# Altium schematic sheet MCU_STM32H743BI.SchDoc: MCU_STM32H743BI
size A3; Author: A.Horvath; Organization: Reichle & De-Massari; Address1: Binzstrasse 32; Address2: 8620 Wetzikon; Address3: Switzerland; DocumentNumber: 10; Revision: V0.1; SheetNumber: 10; SheetTotal: 11
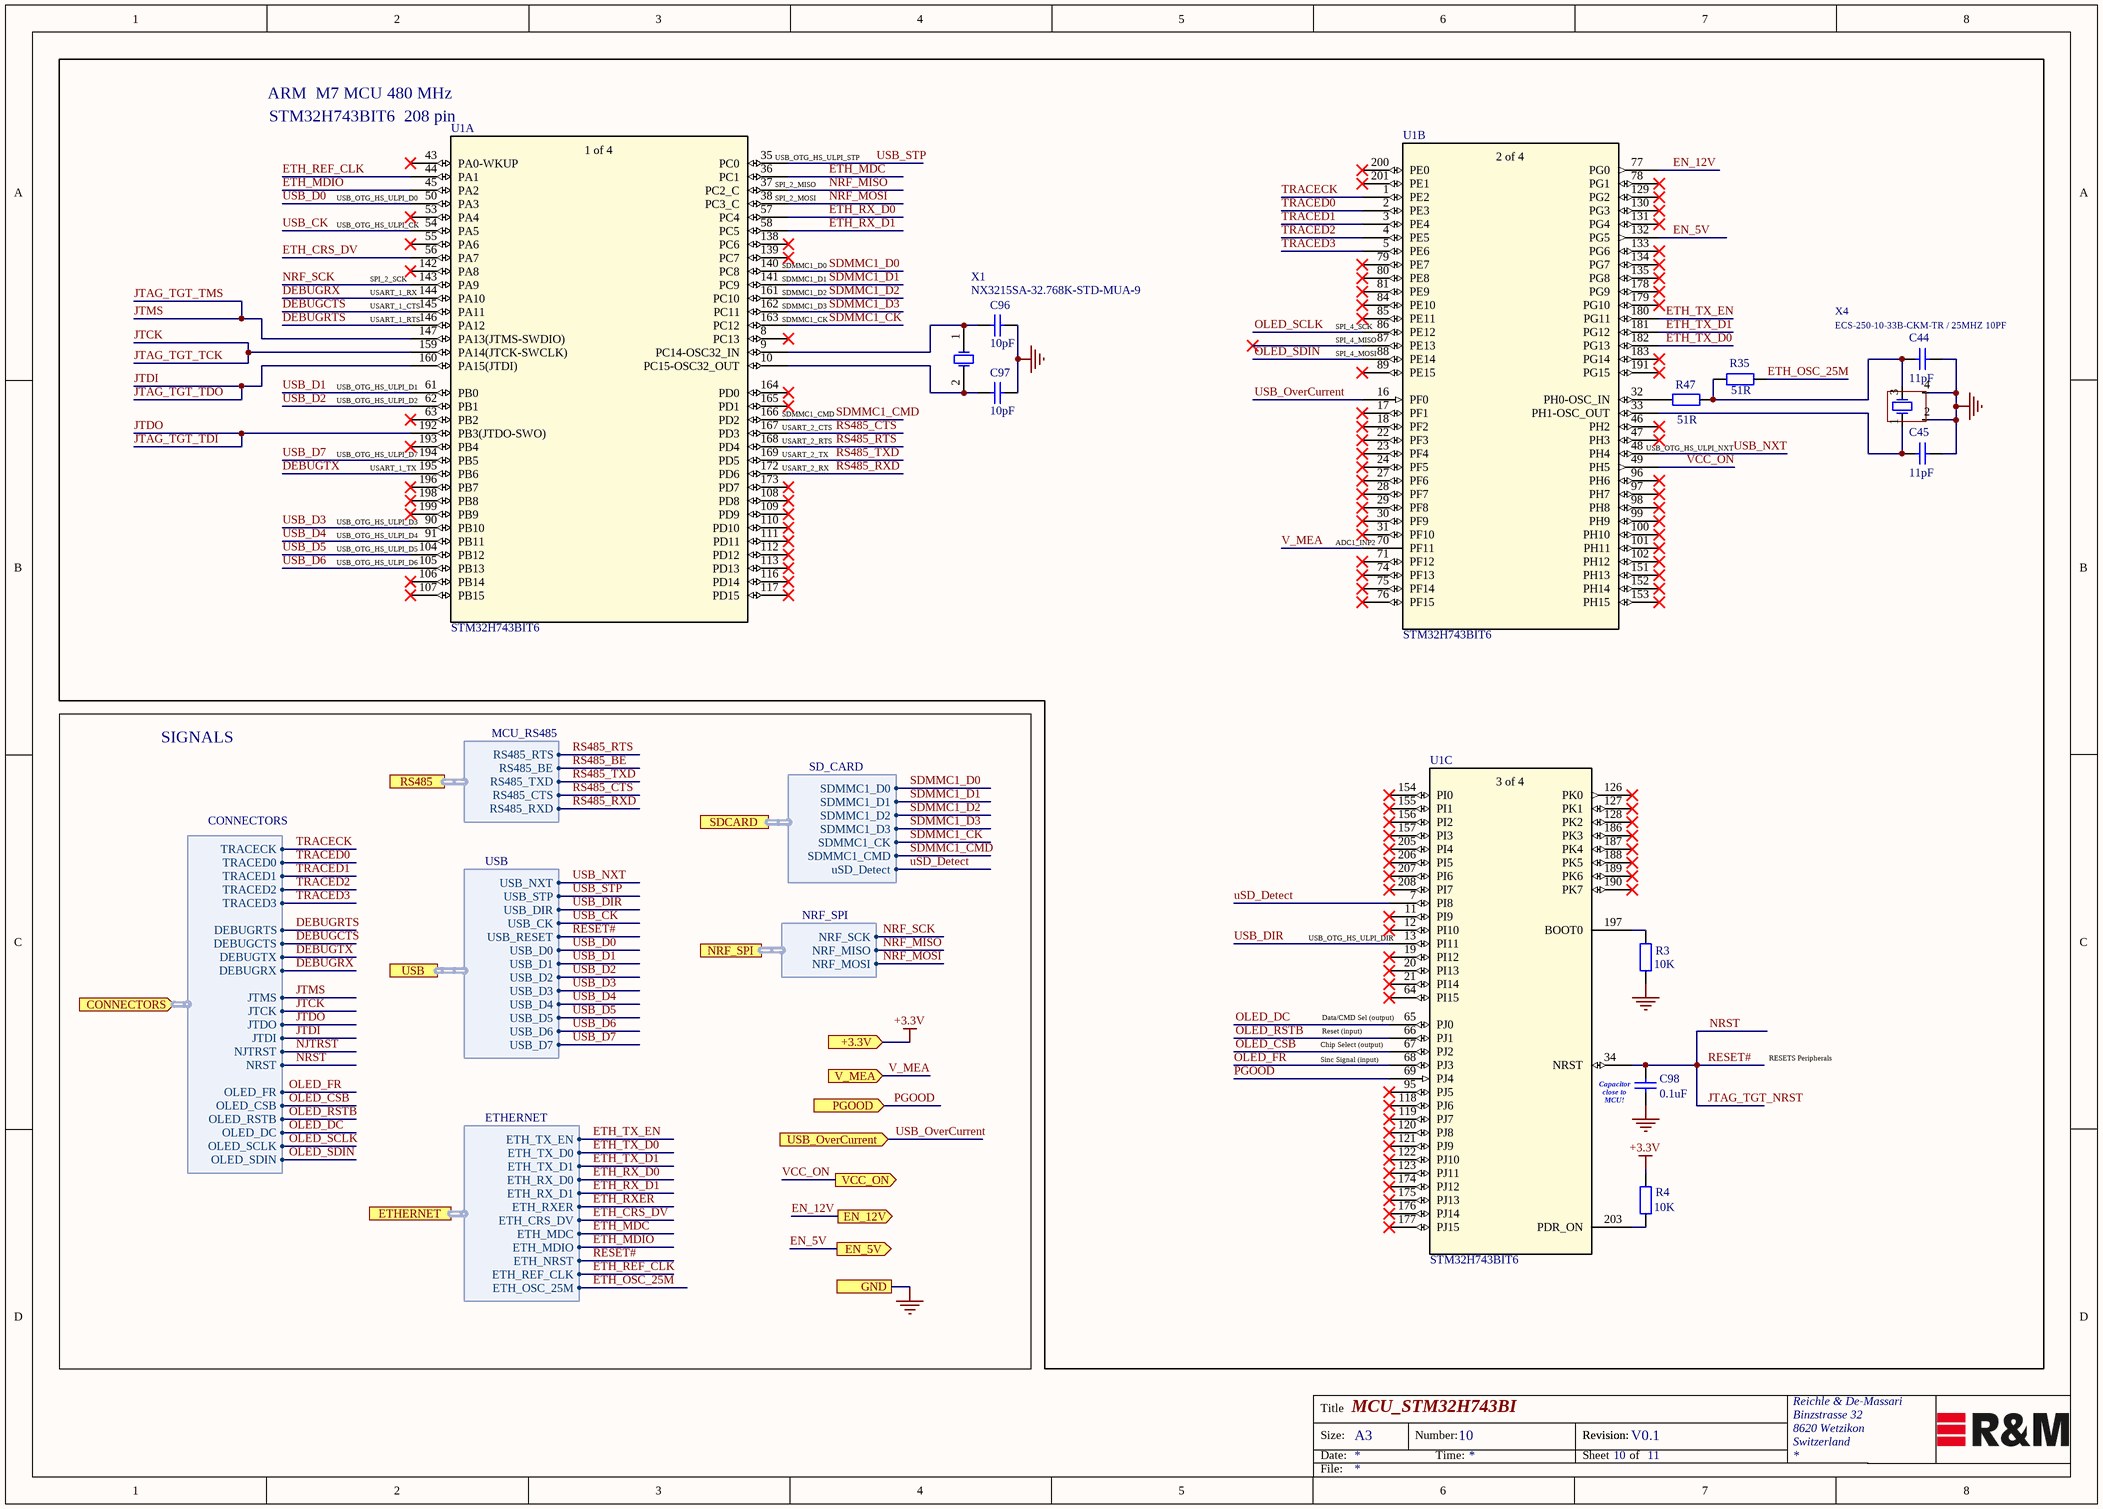
[diagram p0: MCU_STM32H743BI.SchDoc]

## Parts
C44  11pF  [Ceramic Capacitor 0402 EIA]
C45  11pF  [Ceramic Capacitor 0402 EIA]
C96  10pF  [Ceramic Capacitor 0402 EIA]
C97  10pF  [Ceramic Capacitor 0402 EIA]
C98  0.1uF  [Ceramic Capacitor 0402 EIA]
R3  10K  [Resistor 0402 EIA]
R4  10K  [Resistor 0402 EIA]
R35  51R  [Resistor 0402 EIA]
R47  51R  [Resistor 0402 EIA]
U1  STM32H743BIT6  [LQFP208_STM32H743BITx]  (parts A,B,C of 4)
X1  NX3215SA-32.768K-STD-MUA-9  [NX3215SA]
X4  ECS-250-10-33B-CKM-TR / 25MHZ 10PF  [ECS-33B]

## Ports
+3.3V (in), CONNECTORS (in, harness CONNECTORS), EN_5V (out), EN_12V (out), ETHERNET (harness ETHERNET), GND, NRF_SPI (harness NRF_SPI), PGOOD (in), RS485 (harness MCU_RS485), SDCARD (harness SD_CARD), USB (harness USB), USB_OverCurrent (in), V_MEA (in), VCC_ON (out)

## Harnesses
CONNECTORS: OLED_FR, OLED_CSB, OLED_RSTB, OLED_DC, OLED_SCLK, OLED_SDIN, JTMS, JTCK, JTDI, JTDO, NJTRST, NRST, DEBUGRTS, DEBUGCTS, DEBUGTX, DEBUGRX, TRACECK, TRACED0, TRACED1, TRACED2, TRACED3
MCU_RS485: RS485_RXD, RS485_CTS, RS485_TXD, RS485_BE, RS485_RTS
USB: USB_STP, USB_DIR, USB_CK, USB_D0, USB_D1, USB_D2, USB_D3, USB_D4, USB_D5, USB_D6, USB_D7, USB_NXT, USB_RESET
SD_CARD: SDMMC1_D0, SDMMC1_D1, SDMMC1_D2, SDMMC1_D3, SDMMC1_CK, SDMMC1_CMD, uSD_Detect
ETHERNET: ETH_TX_EN, ETH_TX_D0, ETH_TX_D1, ETH_RX_D0, ETH_RX_D1, ETH_RXER, ETH_CRS_DV, ETH_MDC, ETH_MDIO, ETH_NRST, ETH_REF_CLK, ETH_OSC_25M
NRF_SPI: NRF_SCK, NRF_MISO, NRF_MOSI

## Nets
+3.3V: R4.1 ; port +3.3V
GND: C44.1 C45.1 C96.1 C97.1 C98.1 R3.2 X4.2(OSC2) X4.4(OSC3) ; port GND
DEBUGCTS: U1.145(PA11) ; port CONNECTORS.DEBUGCTS
DEBUGRTS: U1.146(PA12) ; port CONNECTORS.DEBUGRTS
DEBUGRX: U1.144(PA10) ; port CONNECTORS.DEBUGRX
DEBUGTX: U1.195(PB6) ; port CONNECTORS.DEBUGTX
EN_5V: U1.132(PG5) ; port EN_5V
EN_12V: U1.77(PG0) ; port EN_12V
ETH_CRS_DV: U1.56(PA7) ; port ETHERNET.ETH_CRS_DV
ETH_MDC: U1.36(PC1) ; port ETHERNET.ETH_MDC
ETH_MDIO: U1.45(PA2) ; port ETHERNET.ETH_MDIO
ETH_OSC_25M: R35.2 ; port ETHERNET.ETH_OSC_25M
ETH_REF_CLK: U1.44(PA1) ; port ETHERNET.ETH_REF_CLK
ETH_RX_D0: U1.57(PC4) ; port ETHERNET.ETH_RX_D0
ETH_RX_D1: U1.58(PC5) ; port ETHERNET.ETH_RX_D1
ETH_RXER: port ETHERNET.ETH_RXER
ETH_TX_D0: U1.182(PG13) ; port ETHERNET.ETH_TX_D0
ETH_TX_D1: U1.181(PG12) ; port ETHERNET.ETH_TX_D1
ETH_TX_EN: U1.180(PG11) ; port ETHERNET.ETH_TX_EN
JTAG_TGT_NRST: C98.2 U1.34(NRST) ; port CONNECTORS.NRST, port USB.USB_RESET, port ETHERNET.ETH_NRST  [also labelled NRST, RESET#]
JTAG_TGT_TCK: U1.159(PA14(JTCK-SWCLK)) ; port CONNECTORS.JTCK  [also labelled JTCK]
JTAG_TGT_TDI: U1.192(PB3(JTDO-SWO)) ; port CONNECTORS.JTDO  [also labelled JTDO]
JTAG_TGT_TDO: U1.160(PA15(JTDI)) ; port CONNECTORS.JTDI  [also labelled JTDI]
JTAG_TGT_TMS: U1.147(PA13(JTMS-SWDIO)) ; port CONNECTORS.JTMS  [also labelled JTMS]
NJTRST: port CONNECTORS.NJTRST
NRF_MISO: U1.37(PC2_C) ; port NRF_SPI.NRF_MISO
NRF_MOSI: U1.38(PC3_C) ; port NRF_SPI.NRF_MOSI
NRF_SCK: U1.143(PA9) ; port NRF_SPI.NRF_SCK
OLED_CSB: U1.67(PJ2) ; port CONNECTORS.OLED_CSB
OLED_DC: U1.65(PJ0) ; port CONNECTORS.OLED_DC
OLED_FR: U1.68(PJ3) ; port CONNECTORS.OLED_FR
OLED_RSTB: U1.66(PJ1) ; port CONNECTORS.OLED_RSTB
OLED_SCLK: U1.86(PE12) ; port CONNECTORS.OLED_SCLK
OLED_SDIN: U1.88(PE14) ; port CONNECTORS.OLED_SDIN
PGOOD: U1.69(PJ4) ; port PGOOD
RS485_BE: port RS485.RS485_BE
RS485_CTS: U1.167(PD3) ; port RS485.RS485_CTS
RS485_RTS: U1.168(PD4) ; port RS485.RS485_RTS
RS485_RXD: U1.172(PD6) ; port RS485.RS485_RXD
RS485_TXD: U1.169(PD5) ; port RS485.RS485_TXD
SDMMC1_CK: U1.163(PC12) ; port SDCARD.SDMMC1_CK
SDMMC1_CMD: U1.166(PD2) ; port SDCARD.SDMMC1_CMD
SDMMC1_D0: U1.140(PC8) ; port SDCARD.SDMMC1_D0
SDMMC1_D1: U1.141(PC9) ; port SDCARD.SDMMC1_D1
SDMMC1_D2: U1.161(PC10) ; port SDCARD.SDMMC1_D2
SDMMC1_D3: U1.162(PC11) ; port SDCARD.SDMMC1_D3
TRACECK: U1.1(PE2) ; port CONNECTORS.TRACECK
TRACED0: U1.2(PE3) ; port CONNECTORS.TRACED0
TRACED1: U1.3(PE4) ; port CONNECTORS.TRACED1
TRACED2: U1.4(PE5) ; port CONNECTORS.TRACED2
TRACED3: U1.5(PE6) ; port CONNECTORS.TRACED3
USB_CK: U1.54(PA5) ; port USB.USB_CK
USB_D0: U1.50(PA3) ; port USB.USB_D0
USB_D1: U1.61(PB0) ; port USB.USB_D1
USB_D2: U1.62(PB1) ; port USB.USB_D2
USB_D3: U1.90(PB10) ; port USB.USB_D3
USB_D4: U1.91(PB11) ; port USB.USB_D4
USB_D5: U1.104(PB12) ; port USB.USB_D5
USB_D6: U1.105(PB13) ; port USB.USB_D6
USB_D7: U1.194(PB5) ; port USB.USB_D7
USB_DIR: U1.13(PI11) ; port USB.USB_DIR
USB_NXT: U1.48(PH4) ; port USB.USB_NXT
USB_OverCurrent: U1.16(PF0) ; port USB_OverCurrent
USB_STP: U1.35(PC0) ; port USB.USB_STP
uSD_Detect: U1.7(PI8) ; port SDCARD.uSD_Detect
V_MEA: U1.70(PF11) ; port V_MEA
VCC_ON: U1.49(PH5) ; port VCC_ON
NetC44_2: C44.2 R35.1 R47.2 X4.3(OSC2)
NetC45_2: C45.2 U1.33(PH1-OSC_OUT) X4.1(OSC1)
NetC96_2: C96.2 U1.9(PC14-OSC32_IN) X1.1(OSC1)
NetC97_2: C97.2 U1.10(PC15-OSC32_OUT) X1.2(OSC2)
NetR3_1: R3.1 U1.197(BOOT0)
NetR4_2: R4.2 U1.203(PDR_ON)
NetR47_1: R47.1 U1.32(PH0-OSC_IN)

Not connected (* = marked no-connect by the designer): U1 8(PC13)* 11(PI9)* 12(PI10)* 17(PF1)* 18(PF2)* 19(PI12)* 20(PI13)* 21(PI14)* 22(PF3)* 23(PF4)* 24(PF5)* 27(PF6)* 28(PF7)* 29(PF8)* 30(PF9)* 31(PF10)* 43(PA0-WKUP)* 46(PH2)* 47(PH3)* 53(PA4)* 55(PA6)* 63(PB2)* 64(PI15)* 71(PF12)* 74(PF13)* 75(PF14)* 76(PF15)* 78(PG1)* 79(PE7)* 80(PE8)* 81(PE9)* 84(PE10)* 85(PE11)* 87(PE13)* 89(PE15)* 95(PJ5)* 96(PH6)* 97(PH7)* 98(PH8)* 99(PH9)* 100(PH10)* 101(PH11)* 102(PH12)* 106(PB14)* 107(PB15)* 108(PD8)* 109(PD9)* 110(PD10)* 111(PD11)* 112(PD12)* 113(PD13)* 116(PD14)* 117(PD15)* 118(PJ6)* 119(PJ7)* 120(PJ8)* 121(PJ9)* 122(PJ10)* 123(PJ11)* 126(PK0)* 127(PK1)* 128(PK2)* 129(PG2)* 130(PG3)* 131(PG4)* 133(PG6)* 134(PG7)* 135(PG8)* 138(PC6)* 139(PC7)* 142(PA8)* 151(PH13)* 152(PH14)* 153(PH15)* 154(PI0)* 155(PI1)* 156(PI2)* 157(PI3)* 164(PD0)* 165(PD1)* 173(PD7)* 174(PJ12)* 175(PJ13)* 176(PJ14)* 177(PJ15)* 178(PG9)* 179(PG10)* 183(PG14)* 186(PK3)* 187(PK4)* 188(PK5)* 189(PK6)* 190(PK7)* 191(PG15)* 193(PB4)* 196(PB7)* 198(PB8)* 199(PB9)* 200(PE0)* 201(PE1)* 205(PI4)* 206(PI5)* 207(PI6)* 208(PI7)*

## Notes on the sheet
- ARM  M7 MCU 480 MHz
- STM32H743BIT6  208 pin
- (near U1) USB_OTG_HS_ULPI_STP
- (near U1) USB_OTG_HS_ULPI_D0
- (near U1) USB_OTG_HS_ULPI_CK
- (near U1) SPI_2_MOSI
- (near U1) SPI_2_MISO
- (near U1) USART_1_CTS
- (near U1) USART_1_RX
- (near U1) SPI_2_SCK
- (near U1) SDMMC1_D1
- (near U1) SDMMC1_D0
- (near U1) SDMMC1_D3
- (near U1) SDMMC1_D2
- (near U1) USART_1_RTS
- (near U1) SDMMC1_CK
- (near U1) SPI_4_SCK
- (near U1) SPI_4_MISO
- (near U1) SPI_4_MOSI
- (near U1) USB_OTG_HS_ULPI_D1
- (near U1) USB_OTG_HS_ULPI_D2
- (near U1) USART_2_CTS
- (near U1) USART_2_RTS
- (near U1) SDMMC1_CMD
- (near U1) USB_OTG_HS_ULPI_NXT
- (near U1) USB_OTG_HS_ULPI_D7
- (near U1) USART_1_TX
- (near U1) USART_2_TX
- (near U1) USART_2_RX
- (near U1) USB_OTG_HS_ULPI_D3
- (near U1) USB_OTG_HS_ULPI_D4
- (near U1) USB_OTG_HS_ULPI_D5
- (near U1) USB_OTG_HS_ULPI_D6
- (near U1) ADC1_INP2
- SIGNALS
- (near U1) USB_OTG_HS_ULPI_DIR
- (near U1) Chip Select (output)
- Reset (input)
- (near U1) Data/CMD Sel (output)
- RESETS Peripherals
- (near U1) Sinc Signal (input)
- Capacitor close to MCU!
- Title
- Size:
- Date:
- A3
- Number:
- Time:
- Revision:
- Sheet
- of
- File:
- (in symbol STM32H7x3BIT, part A) 1 of 4
- (in symbol STM32H7x3BIT, part B) 2 of 4
- (in symbol STM32H7x3BIT, part C) 3 of 4

## Library data of the parts
C44 C45 = Cap_11pF_0402_50V: 11pF ±5% 50V Ceramic Capacitor C0G, NP0 0402 (1005 Metric); Manufacturer: Murata; Manufacturer PartNr: GRM1555C1H110JA01D; voltage: 50VDC; Replaceable: yes; Dielectric Grade: C0G (NP0); value: 11pF; tolerance: 5%; Footprint/Package: 0402 (1005 metric); ComponentLink1Description: mouser; ComponentLink1URL: https://www.mouser.ch/ProductDetail/Murata-Electronics/GRM1555C1H110JA01D?qs=%2fha2pyFadug34NHqLs7eMMmZ4IY%2fB%2fBwtGmZmE%252bqlNJIuNiWKDU4cio3ILTIjZ7Z; Supplier 2: Mouser; Supplier 1: Digi-Key; Supplier Part Number 2: 81-GRM1555C1H110JA1D; Supplier Part Number 1: 490-5923-6-ND
C96 C97 = Cap_10pF_0402_50V: 10pF ±1% 50V Ceramic Capacitor C0G, NP0 0402 (1005 Metric); Manufracturer: Murata Electronics; Manufacturer PartNr: GJM1555C1H100FB01D; voltage: 50VDC; Replaceable: yes; Dielectric Grade: C0G (NP0); tolerance: 1%; ComponentLink1Description: mouser; ComponentLink1URL: https://www.mouser.ch/ProductDetail/Murata-Electronics/GRM155R60J475ME47D?qs=sGAEpiMZZMs0AnBnWHyRQIE6q%2f4qwWvwbJmEUwav8%2f4%3d; Footprint/Package: 0402 (1005 metric); Supplier 2: Mouser; Supplier Part Number 2: 81-GJM1555C1H100FB01; value: 10pF; Supplier 1: Digi-Key; Supplier Part Number 1: 0402 (1005 Metric)
C98 = Cap_0.1uF_0402_10V: 0.1µF ±20% 10V Ceramic Capacitor X5R 0402 (1005 Metric); Manufacturer: Wurth Electronics; Manufacturer PartNr: 885012105010; voltage: 10VDC; Replaceable: yes; value: 0.1uF; tolerance: 20%; Footprint/Package: 0402; Dielectric Grade: X5R; ComponentLink1Description: mouser; ComponentLink1URL: https://www.mouser.ch/ProductDetail/Wurth-Electronics/885012105010?qs=sGAEpiMZZMs0AnBnWHyRQEGbLOF2VP1ihL84oCjXnlO407YOHi%2fQbw%3d%3d; Supplier 3: Mouser; Supplier 2: Farnell; Supplier 1: Digi-Key; Supplier Part Number 1: 732-7487-1-ND; Supplier Part Number 2: 2533928; Supplier Part Number 3: 710-885012105010
R3 R4 = Res_10K_0402: SMD 10K ohm 1% 50V General Purpose; Manufacturer: Yageo; Manufacturer PartNr: RC0402FR-1010KL; power: 63mW; Replaceable: yes; value: 10K; tolerance: 1%; ComponentLink1Description: mouser; ComponentLink1URL: https://www.mouser.ch/ProductDetail/Yageo/RC0402FR-1010KL?qs=sGAEpiMZZMtlubZbdhIBIEgN9MQql2m6Sb2LnYlCICU%3d; Footprint/Package: 0402; Supplier 1: Mouser; Supplier Part Number 1: 603-RC0402FR-1010KL; Supplier 2: Digi-Key; Supplier Part Number 2: *
R35 R47 = Res_51R_0402_0.5%: 51 Ohms ±0.5% 0.063W, 1/16W Chip Resistor 0402 (1005 Metric) Thin Film; Manufacturer: Susumu; Manufacturer PartNr: RR0510R-510-D; power: 62.5mW; Replaceable: yes; value: 51R; tolerance: ±0.5%; Footprint/Package: 0402 (1005  metric); ComponentLink1Description: mouser; ComponentLink1URL: https://www.mouser.ch/ProductDetail/Yageo/RC0402JR-0751RL?qs=sGAEpiMZZMtG0KNrPCHnjTtiZEI2zSDg2UFCMmEjZXQ%3d; Supplier 1: Digi-Key; Supplier Part Number 1: RR05R51DCT-ND
U1 = STM32H7x3BIT: ARM Cortex-M7 STM32H7 Mikrocontroller IC 32-Bit 480MHz 2MB (2M x 8) FLASH 208-LQFP (28x28); Manufacturer: STMicroelectronics; voltage: 1,62V-3.6V; Replaceable: no; value: STM32H743BIT6; Type: Type; DIelectric Grade: -; Manufacturer PartNr: STM32H743BIT6; power: -; Supplier 1: Digi-Key; Supplier Part Number 1: 497-18562-ND; Footprint/Package: 208-LQFP (28x28); tolerance: -
X1 = CRYSTAL_2Pin_ NX3215SA-32.768K-STD-MUA-9: 32.768kHz ±20ppm Crystal 9pF 70 kOhms 2-SMD, No Lead; Manufacturer: NDK America; Replaceable: no; Footprint/Package: 2-SMD, specific see datasheet; voltage: -; Manufacturer PartNr: NX3215SA-32.768K-STD-MUA-9; value: NX3215SA-32.768K-STD-MUA-9; Supplier 1: Digi-Key; Supplier Part Number 1: 644-1155-1-ND; tolerance: ±20ppm; Dielectric Grade: -; power: -
X4 = CRYSTAL_4Pad_ECS-250-10-33B-CKM-TR: 25MHz ±10ppm Crystal 10pF 40 Ohms 4-SMD, No Lead; Manufacturer: ESC Inc.; Replaceable: no; Manufacturer PartNr: ECS-250-10-33B-CKM-TR; Footprint/Package: 4-SMD, No Lead; Supplier 1: Digi-Key; Supplier Part Number 1: XC2479DKR-ND; ComponentLink1Description: digikey; ComponentLink1URL: https://www.digikey.com/product-detail/en/abracon-llc/ABM3-12.000MHZ-B2-T/535-9100-2-ND/675295; Load Capacitance: 10 pF; value: ECS-250-10-33B-CKM-TR / 25MHZ 10PF; Dielectric Grade: -; voltage: -